# Altium project SlowDown.PrjPCB
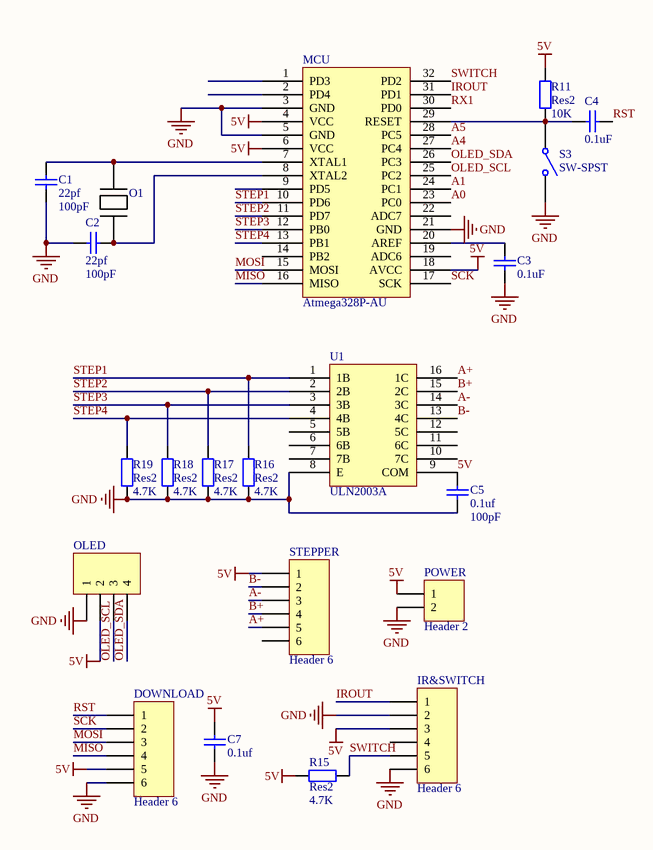
[diagram p0: SlowDown!V1.0.SchDoc]
1 sheet, 21 parts. Net scope: global (net labels, ports and power ports of the same name join across sheets).
Board file: SlowDown!V1.0.PcbDoc

## Sheet SlowDown!V1.0.SchDoc
size A4

### Parts
C1  22pf  value 100pF  [0603Standard]
C2  22pf  value 100pF  [0603Standard]
C3  0.1uF  [0603Standard]
C4  0.1uF  [0603Standard]
C5  0.1uf  value 100pF  [0603Standard]
C7  0.1uf  [0603Standard]
DOWNLOAD  Header 6  [SH-6P]
IR&SWITCH  Header 6  [SH-6P]
MCU  Atmega328P-AU  [ATMega328P-AU]
O1  16M  [16MHZ20PF]  (value not drawn)
OLED  Header 4  [SH-4P]  (value not drawn)
POWER  Header 2  [HDR1X2]
R11  Res2  value 10K  [0603Standard]
R15  Res2  value 4.7K  [0603Standard]
R16  Res2  value 4.7K  [0603Standard]
R17  Res2  value 4.7K  [0603Standard]
R18  Res2  value 4.7K  [0603Standard]
R19  Res2  value 4.7K  [0603Standard]
S3  SW-SPST  [BUTTOM]
STEPPER  Header 6  [SH-6P]
U1  ULN2003A  [ULN2003A_SOP16]

### Nets
5V: C5.1 C7.1 DOWNLOAD.5 IR&SWITCH.3 MCU.4(VCC) MCU.6(VCC) MCU.18(AVCC) OLED.2 POWER.1 R11.1 R15.2 STEPPER.1 U1.9(COM)
GND: C1.1 C2.1 C3.1 C5.2 C7.2 DOWNLOAD.6 IR&SWITCH.2 IR&SWITCH.6 MCU.3(GND) MCU.5(GND) MCU.21(GND) OLED.1 POWER.2 R16.1 R17.1 R18.1 R19.1 S3.2(NO) U1.8(E)
A0: MCU.23(PC0)
A1: MCU.24(PC1)
A4: MCU.27(PC4)
A5: MCU.28(PC5)
A+: STEPPER.5 U1.16(1C)
A-: STEPPER.3 U1.14(3C)
B+: STEPPER.4 U1.15(2C)
B-: STEPPER.2 U1.13(4C)
IROUT: IR&SWITCH.1 MCU.31(PD1)
MISO: DOWNLOAD.4 MCU.16(MISO)
MOSI: DOWNLOAD.3 MCU.15(MOSI)
OLED_SCL: MCU.25(PC2) OLED.3
OLED_SDA: MCU.26(PC3) OLED.4
RST: C4.2 DOWNLOAD.1
RX1: MCU.30(PD0)
SCK: DOWNLOAD.2 MCU.17(SCK)
STEP1: MCU.10(PD6) R16.2 U1.1(1B)
STEP2: MCU.11(PD7) R17.2 U1.2(2B)
STEP3: MCU.12(PB0) R18.2 U1.3(3B)
STEP4: MCU.13(PB1) R19.2 U1.4(4B)
SWITCH: IR&SWITCH.5 MCU.32(PD2) R15.1
NetC1_2: C1.2 MCU.7(XTAL1) O1.2
NetC2_2: C2.2 MCU.8(XTAL2) O1.1
NetC3_2: C3.2 MCU.20(AREF)
NetC4_1: C4.1 MCU.29(RESET) R11.2 S3.1(COMMON)

Not connected (* = marked no-connect by the designer): IR&SWITCH 4; MCU 1(PD3) 2(PD4) 9(PD5) 14(PB2) 19(ADC6) 22(ADC7); STEPPER 6; U1 5(5B) 6(6B) 7(7B) 10(7C) 11(6C) 12(5C)

### Library data of the parts
C1 C2 C5 = Cap: Capacitor; Published: 8-Jun-2000; LatestRevisionDate: 17-Jul-2002; LatestRevisionNote: Re-released for DXP Platform.; PackageReference: RAD-0.3; Publisher: Altium Limited; PackageDescription: Radial Cap, Thru-Hole; 2 Leads; 0.3 in Pin Spacing
C3 C4 = cap: Capacitor
C7 = Cap: Capacitor; Value: 100pF; Published: 8-Jun-2000; LatestRevisionDate: 17-Jul-2002; LatestRevisionNote: Re-released for DXP Platform.; PackageReference: RAD-0.3; Publisher: Altium Limited; PackageDescription: Radial Cap, Thru-Hole; 2 Leads; 0.3 in Pin Spacing
DOWNLOAD IR&SWITCH STEPPER = Header 6: Header, 6-Pin; LatestRevisionDate: 17-Jul-2002; LatestRevisionNote: Re-released for DXP Platform.; Publisher: Altium Limited
O1 = Crystal Osc 16M
OLED = Header 4: Header, 4-Pin; LatestRevisionDate: 17-Jul-2002; LatestRevisionNote: Re-released for DXP Platform.; Publisher: Altium Limited
POWER = Header 2: Header, 2-Pin; LatestRevisionDate: 17-Jul-2002; LatestRevisionNote: Re-released for DXP Platform.; Publisher: Altium Limited
R11 R15-R19 = Res2: Resistor; Published: 8-Jun-2000; LatestRevisionDate: 17-Jul-2002; LatestRevisionNote: Re-released for DXP Platform.; PackageReference: AXIAL-0.4; Publisher: Altium Limited; PackageDescription: Axial Device, Thru-Hole; 2 Leads; 0.4 in Pin Spacing
S3 = SW-SPST: Single-Pole, Single-Throw Switch; Published: 24-Mar-1999; LatestRevisionDate: 17-Jul-2002; LatestRevisionNote: Re-released for DXP Platform.; PackageReference: SPST-2; Publisher: Altium Limited; PackageDescription: Switch; 2 Leads